# Altium schematic sheet BeagleBone_Card.SchDoc
size A4; Engineer: Mehmet Selcuk Yayan; Organization: Procenne
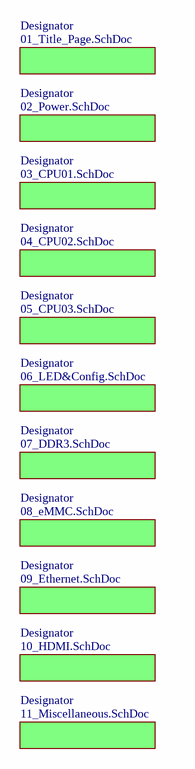
[diagram p0: BeagleBone_Card.SchDoc]

## Sub-sheets
Designator = 02_Power.SchDoc: no entries
Designator = 03_CPU01.SchDoc: no entries
Designator = 04_CPU02.SchDoc: no entries
Designator = 05_CPU03.SchDoc: no entries
Designator = 06_LED&Config.SchDoc: no entries
Designator = 07_DDR3.SchDoc: no entries
Designator = 08_eMMC.SchDoc: no entries
Designator = 09_Ethernet.SchDoc: no entries
Designator = 10_HDMI.SchDoc: no entries
Designator = 11_Miscellaneous.SchDoc: no entries
Designator = 01_Title_Page.SchDoc: no entries

## Notes on the sheet
- © 2020 Procenne Systems
- Title:
- Size:
- A4
- Number:
- Date:
- Rev:
- Sheet
- of